# EAGLE design nodeSensor (EAGLE 6.5.0)
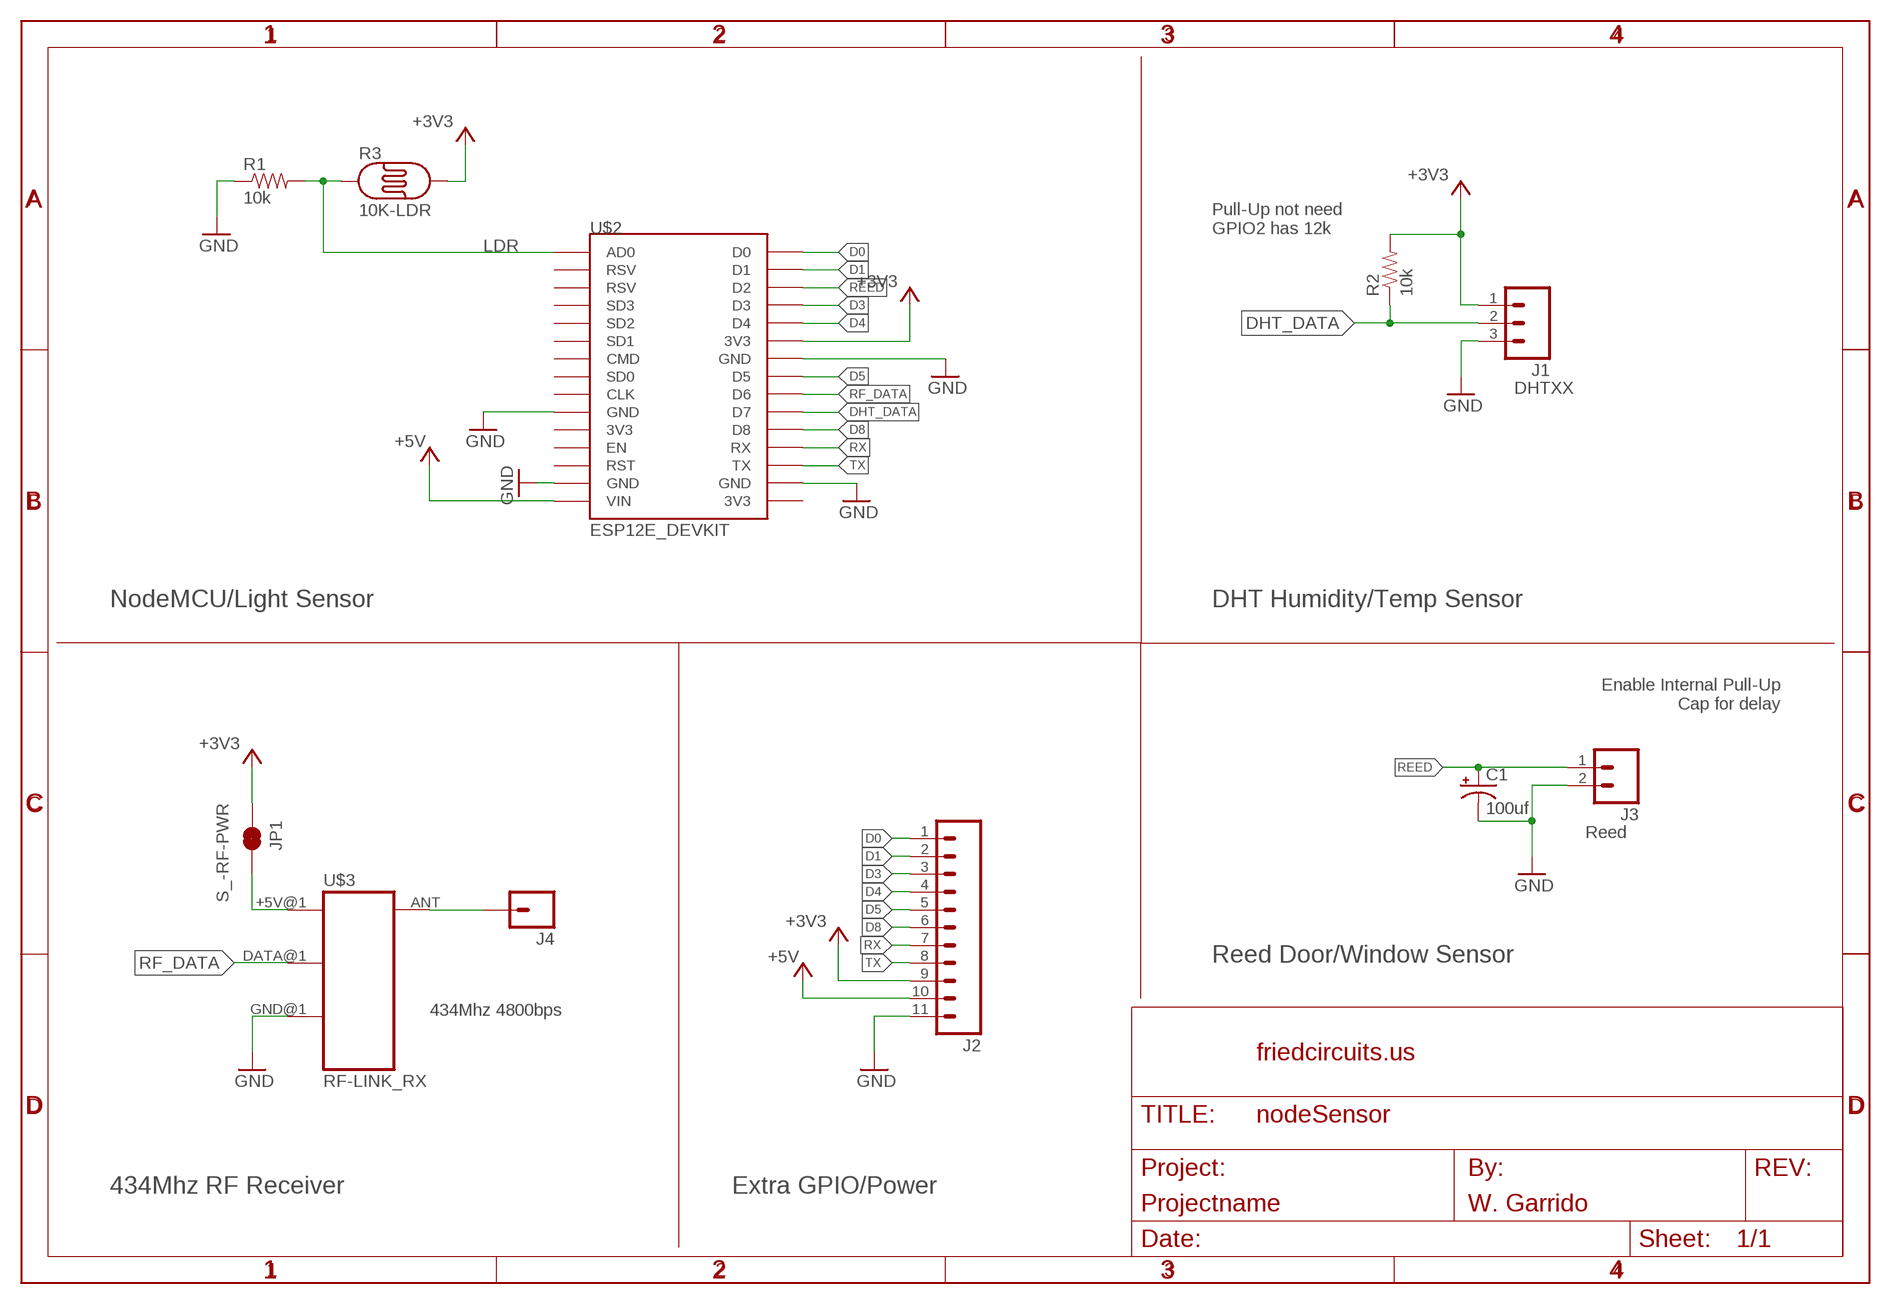
[diagram p0: schematic, sheet 1]

## Parts
C1  100uf  CAP_POLPTH4  [CPOL-RADIAL-1000UF-25V]
J1  M03LOCK  [1X03_LOCK]
J2  M11LOCK  [1X11_LOCK]
J3  M02LOCK  [1X02_LOCK]
J4  M01PTH_LONGPAD  [1X01_LONGPAD]
JP1  S_-RF-PWR  JUMPER-PAD-2-NC_BY_TRACE  [PAD-JUMPER-2-NC_BY_TRACE_YES_SILK]
R1  10k  RESISTORKIT  [AXIAL-0.3-KIT]
R2  10k  RESISTORKIT  [AXIAL-0.3-KIT]
R3  10K-LDR  PHOTOCELLPTH  [PHOTOCELL]
U$1  FRAME_DINA4_L  [FC_CREDIT]
U$2  ESP12E_DEVKIT  [ESP12E_DEVKIT]
U$3  RF-LINK_RX  [RF-LINK_RX]

## Nets
+3V3 [Power]: J1.1 J2.9 JP1.1 R2.P$2 R3.2 U$2.3V3@1(3V3)
+5V: J2.10 U$2.VIN
D0: J2.1 U$2.D0
D1: J2.2 U$2.D1
D3: J2.3 U$2.D3
D4: J2.4 U$2.D4
D5: J2.5 U$2.D5
D8: J2.6 U$2.D8
DHT_DATA: J1.2 R2.P$1 U$2.D7
GND: C1.2(-) J1.3 J2.11 J3.2 R1.P$1 U$2.GND@0(GND) U$2.GND@1(GND) U$2.GND@2(GND) U$2.GND@3(GND) U$3.GND@1(GND)
LDR: R1.P$2 R3.1 U$2.AD0
N$4: J4.1 U$3.ANT
N$5 [Power]: JP1.2 U$3.+5V@1(+5V)
REED: C1.1(+) J3.1 U$2.D2
RF_DATA: U$2.D6 U$3.DATA@1(DATA)
RX: J2.7 U$2.RX
TX: J2.8 U$2.TX
Unconnected: U$2.3V3@0(3V3) U$2.3V3@2(3V3) U$2.CLK U$2.CMD U$2.EN U$2.RST U$2.RSV@0(RSV) U$2.RSV@1(RSV) U$2.SD0 U$2.SD1 U$2.SD2 U$2.SD3

## Notes on the sheet
- Pull-Up not need
  GPIO2 has 12k
- DHTXX
- NodeMCU/Light Sensor | DHT Humidity/Temp Sensor
- Enable Internal Pull-Up
  Cap for delay
- Reed
- Reed Door/Window Sensor
- 434Mhz 4800bps
- 434Mhz RF Receiver | Extra GPIO/Power

## Library data of the parts
C1 = SparkFun-Passives:CAP_POL: Capacitor Polarized These are standard SMD and PTH capacitors. Normally 10uF, 47uF, and 100uF in electrolytic and tantalum varieties. Always verify the external diameter of the through hole cap, it varies with capacity, voltage, and manufacturer. The EIA devices should be standard.
J1 = SparkFun-Connectors:M03: Header 3 Standard 3-pin 0.1" header. Use with straight break away headers (SKU : PRT-00116), right angle break away headers (PRT-00553), swiss pins (PRT-00743), machine pins (PRT-00117), and female headers (PRT-00115). Molex polarized connector foot print use with SKU : PRT-08232 with associated crimp pins and housings.
J2 = SparkFun-Connectors:M11: Header 11 Standard 11-pin 0.1" header. Use with straight break away headers (SKU : PRT-00116), right angle break away headers (PRT-00553), swiss pins (PRT-00743), machine pins (PRT-00117), and female headers (PRT-00115).
J3 = SparkFun-Connectors:M02: Standard 2-pin 0.1" header. Use with - straight break away headers ( PRT-00116) - right angle break away headers (PRT-00553) - swiss pins (PRT-00743) - machine pins (PRT-00117) - female headers (PRT-00115) Molex polarized connector foot print use with: PRT-08233 with associated crimp pins and housings. 2.54_SCREWTERM for use with PRT-10571. 3.5mm Screw Terminal footprints for PRT-08084 5mm Screw Terminal footprints for use with PRT-08432
J4 = SparkFun-Connectors:M01: Header 1 Standard 1-pin 0.1" header. Use with straight break away headers (SKU : PRT-00116), right angle break away headers (PRT-00553), swiss pins (PRT-00743), machine pins (PRT-00117), and female headers (PRT-00115). SMTSO-256-ET is a "flush mount" nut for a 4-40 screw. The older package used to be too tight, and did not allow it to sit properly thru the drill hit. The latest (0.165DIA) fits nice and snug.
JP1 = SparkFun-Passives:JUMPER-PAD-2-NC_BY_TRACE
R1 R2 = SparkFun-Passives:RESISTOR: Resistor Basic schematic elements and footprints for 0603, 1206, and PTH resistors.
R3 = SparkFun:PHOTOCELL: Photocell Also known as a CdS photoresistor. This is a low cost way to detect light levels. Resistance decreases with more incoming light. SparkFun SKU: SEN-09088
U$1 = FriedCircuits:FRAME_DINA4_L: A4 FC frame Standard FriedCircuits schematic frame. Automagically adds the standard texts to the PCB Use the atrribute in the schematic editor to change the fields.; AUTHOR: W. Garrido; FF1: by; FF2: FriedCircuits; PROJECT: Projectname; URL1: friedcircuits.us
U$2 = ESP12E_DEVKIT:ESP12E_DEVKIT: ESP12E DEVKIT BOARD
U$3 = SparkFun-RF:RF-LINK_RX: RF Link receivers- WRL-8947, 8948, 8949, 8950, 10532, 10533

## Net classes
0 Signal: width 0.33 mm, drill 0.33 mm, clearance 0.254 mm
1 Power: width 0.406 mm, drill 0.406 mm, clearance 0.254 mm

## Board
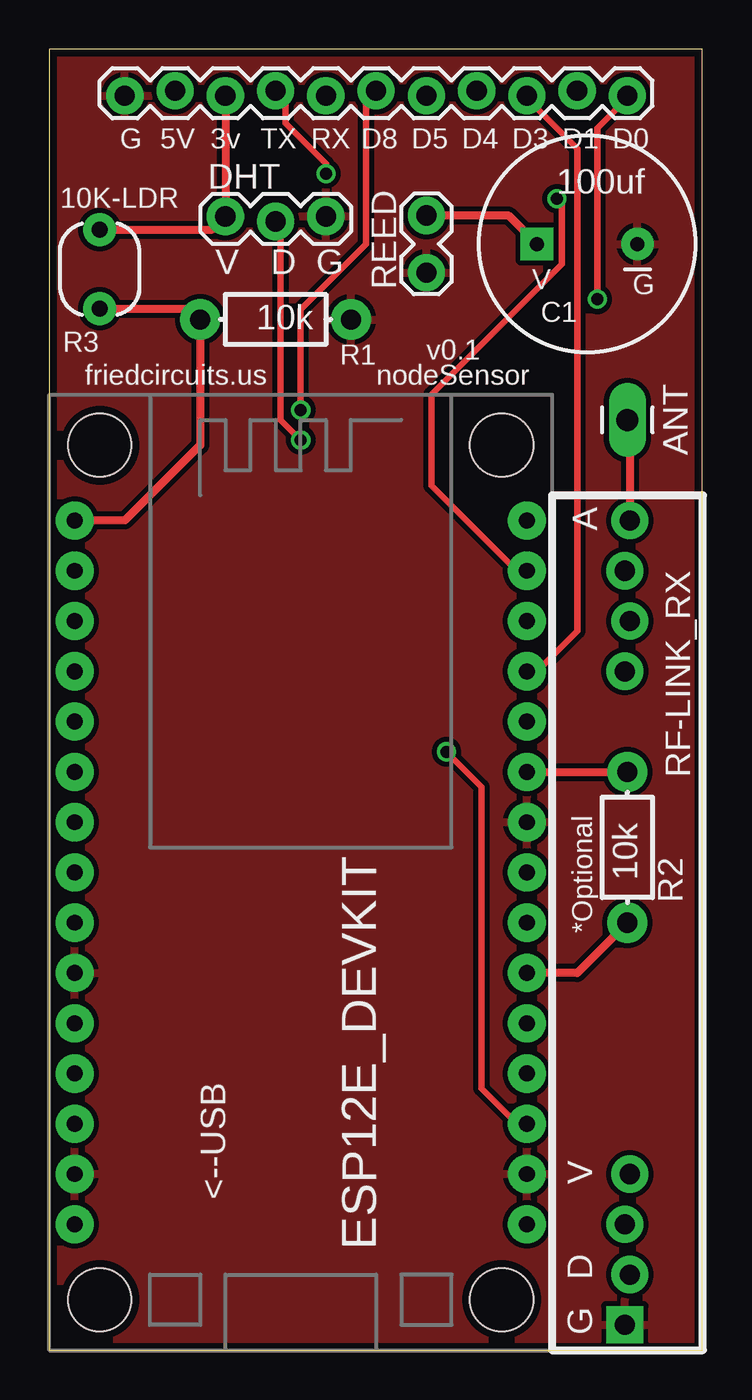
[diagram p1: board, top side]
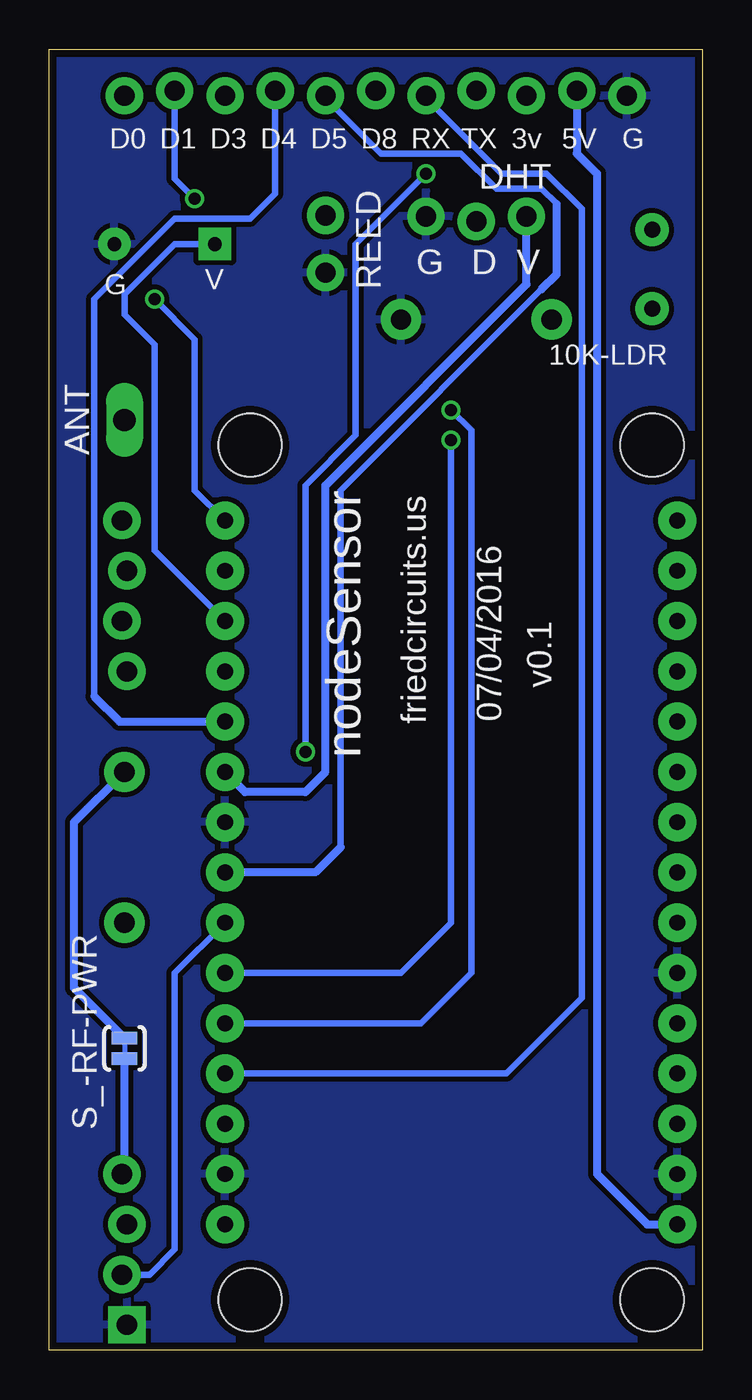
[diagram p2: board, bottom side, seen from below]

Size 33 x 65.71 mm. Coordinates in mm from the lower left corner, seen from the top.
Outline: 0,0 33,0 33,65.71 0,65.71 0,0
Copper layers (1*16): Top 0.0356mm / dielectric 1.5011mm / Bottom 0.0356mm
Design rules "LaenPCBOrder *": minimum track width 6mil, minimum drill 13mil, track to track 6mil, track to pad 6mil, pad to pad 6mil, via to via 6mil, smd to smd 6mil, copper to edge 15mil, drill to drill 6mil, minimum pad ring 7mil, minimum via ring 7mil, stop-mask expansion 4mil, vias tented up to drill 24mil, thermal gap 10mil

### Footprints (pad centres in the part's own frame; a part is rotated, then mirrored left to right if it is on the bottom)
CPOL-RADIAL-1000UF-25V = drill 0.7 pad 1.651 square: 1 2.54,0 | drill 0.7 pad 1.651: 2 -2.54,0
1X03_LOCK = drill 1.016 pad 1.88: 1 0,0.127; 2 2.54,-0.127; 3 5.08,0.127
1X11_LOCK = drill 1.016 pad 1.88: 1 0,0.127; 2 2.54,-0.127; 3 5.08,0.127; 4 7.62,-0.127; 5 10.16,0.127; 6 12.7,-0.127; 7 15.24,0.127; 8 17.78,-0.127; 9 20.32,0.127; 10 22.86,-0.127; 11 25.4,0.127
1X02_LOCK = drill 1.016 pad 1.88: 1 -0.178,0; 2 2.718,0
1X01_LONGPAD = drill 1.118 pad 1.88 long: 1 0,0
PAD-JUMPER-2-NC_BY_TRACE_YES_SILK = smd 0.635 x 1.27: 1 -0.508,0; 2 0.508,0
AXIAL-0.3-KIT = drill 1.016 pad 2.032: P$1 -3.81,0; P$2 3.81,0
PHOTOCELL = drill 0.8 pad 1.676: 1 -2,0; 2 2,0
ESP12E_DEVKIT = drill 0.8 pad 1.93: 3V3@0 -11.43,-7.62; 3V3@1 11.43,5.08; 3V3@2 11.43,-17.78; AD0 -11.43,17.78; CLK -11.43,-2.54; CMD -11.43,2.54; D0 11.43,17.78; D1 11.43,15.24; D2 11.43,12.7; D3 11.43,10.16; D4 11.43,7.62; D5 11.43,0; D6 11.43,-2.54; D7 11.43,-5.08; D8 11.43,-7.62; EN -11.43,-10.16; GND@0 -11.43,-5.08; GND@1 -11.43,-15.24; GND@2 11.43,2.54; GND@3 11.43,-15.24; RST -11.43,-12.7; RSV@0 -11.43,15.24; RSV@1 -11.43,12.7; RX 11.43,-10.16; SD0 -11.43,0; SD1 -11.43,5.08; SD2 -11.43,7.62; SD3 -11.43,10.16; TX 11.43,-12.7; VIN -11.43,-17.78 | hole 3.2: -10.16,21.59; 10.16,21.59; 10.16,-21.59; -10.16,-21.59
RF-LINK_RX = drill 1.016 pad 1.88: +5V@1 7.62,-0.127; +5V@2 33.02,0.127; ANT 40.64,-0.127; DATA@1 2.54,-0.127; DATA@2 5.08,0.127; GND@2 35.56,-0.127; GND@3 38.1,0.127 | drill 1.016 pad 1.88 square: GND@1 0,0.127

### Placement (x,y rotation side)
C1  27.18,55.88 180 top
J1  8.89,57.15 0 top
J2  29.21,63.5 180 top
J3  19.05,57.15 270 top
J4  29.21,46.99 180 top
JP1  29.21,15.24 270 bottom
R1  11.43,52.07 180 top
R2  29.21,25.4 90 top
R3  2.54,54.61 90 top
U$1  -16.51,40.64 0 top  (outside the outline)
U$2  12.7,24.13 0 top
U$3  29.21,1.27 90 top

### Tracks (layer width: path | path; a pad name or v marks a point on that pad's centre or on a via)
+3V3
  Top 0.406: R3.2 8.22,56.61 J1.1 J2.9 | U$2.3V3@1 R2.P$2
  Bottom 0.406: JP1.1 31.75,18.29 31.75,26.67 R2.P$2 | J1.1 8.89,53.85 19.05,43.69 19.05,29.21 20.07,28.19 23.11,28.19 U$2.3V3@1
+5V
  Bottom 0.406: J2.10 6.35,60.45 5.33,59.44 5.33,8.89 2.79,6.35 U$2.VIN
D0  (via drill 0.61)
  Top 0.33: v27.69,53.09 27.69,61.72 29.21,63.25 J2.1
  Bottom 0.33: v27.69,53.09 25.65,51.05 25.65,44.45 25.65,43.43 U$2.D0
D1  (via drill 0.61)
  Top 0.33: v25.65,58.17 25.91,57.91 25.91,54.86 19.3,48.26 19.3,43.69 23.62,39.37 U$2.D1
  Bottom 0.33: J2.2 26.67,59.18 v25.65,58.17
D3
  Top 0.33: U$2.D3 24.64,34.29 26.67,36.32 26.67,60.71 24.13,63.25 J2.3
D4
  Bottom 0.33: 30.73,33.02 30.73,53.09 26.67,57.15 22.86,57.15 21.59,58.42 J2.4
  Bottom 0.406: 30.73,33.02 29.46,31.75 U$2.D4
D5
  Bottom 0.33: 7.37,57.91 8.13,58.67 10.41,58.67 12.19,60.45 16.26,60.45 19.05,63.25 J2.5 | 8.13,53.59 18.29,43.43 18.29,25.4
  Bottom 0.406: 8.13,53.59 7.37,54.36 7.37,57.91 | 18.29,25.4 19.56,24.13 U$2.D5
D8  (via drill 0.61)
  Top 0.33: v12.7,47.5 12.7,52.58 16,55.88 16,62.99 16.51,63.5 J2.6
  Bottom 0.33: v12.7,47.5 11.68,46.48 11.68,19.05 14.22,16.51 U$2.D8
DHT_DATA  (via drill 0.61)
  Top 0.33: v12.7,45.97 11.68,46.99 11.68,56.64 11.43,56.9 J1.2
  Top 0.406: R2.P$1 26.67,19.05 U$2.D7
  Bottom 0.33: v12.7,45.97 12.7,21.59 15.24,19.05 U$2.D7
GND
  pour Bottom: 0,66.04 33.02,66.04 33.02,0 0,0
  pour Top: 0,66.04 33.02,66.04 33.02,0 0,0
LDR
  Top 0.406: R3.1 7.08,52.61 R1.P$2 7.62,45.72 3.81,41.91 U$2.AD0
N$4
  Top 0.406: J4.1 29.34,46.86 U$3.ANT
N$5
  Bottom 0.406: U$3.+5V@1 29.21,9.02 JP1.2
REED
  Top 0.406: J3.1 23.19,57.33 C1.1
  Bottom 0.33: U$2.D2 27.69,40.39 27.69,50.8 29.21,52.32 29.21,53.34 26.67,55.88 C1.1
RF_DATA
  Bottom 0.33: U$2.D6 26.67,19.05 26.67,5.08 27.94,3.81 U$3.DATA@1
RX
  Bottom 0.33: J2.7 13.97,63.25 10.16,59.44 7.87,59.44 6.1,57.66 6.1,17.78 9.91,13.97 U$2.RX
TX  (via drill 0.61)
  Top 0.33: v13.97,59.44 13.97,59.94 11.94,61.98 11.94,62.99 11.43,63.5 J2.8 | v20.07,30.23 21.84,28.45 21.84,13.21 23.62,11.43 U$2.TX
  Bottom 0.33: v13.97,59.44 17.53,55.88 17.53,46.23 20.07,43.69 v20.07,30.23

### Text on the board
tPlace: G | 5V | 3v | TX | RX | D8 | D5 | D4 | D3 | D1 | D0 | DHT | V | D | G | REED | V | G | v0.1 | friedcircuits.us | nodeSensor | ANT | A | *Optional | <--USB | V | D | G
bPlace: G | 5V | 3v | TX | RX | D8 | D5 | D4 | D3 | D1 | D0 | DHT | V | D | G | REED | V | G | 10K-LDR | ANT | friedcircuits.us | nodeSensor | 07/04/2016 | v0.1